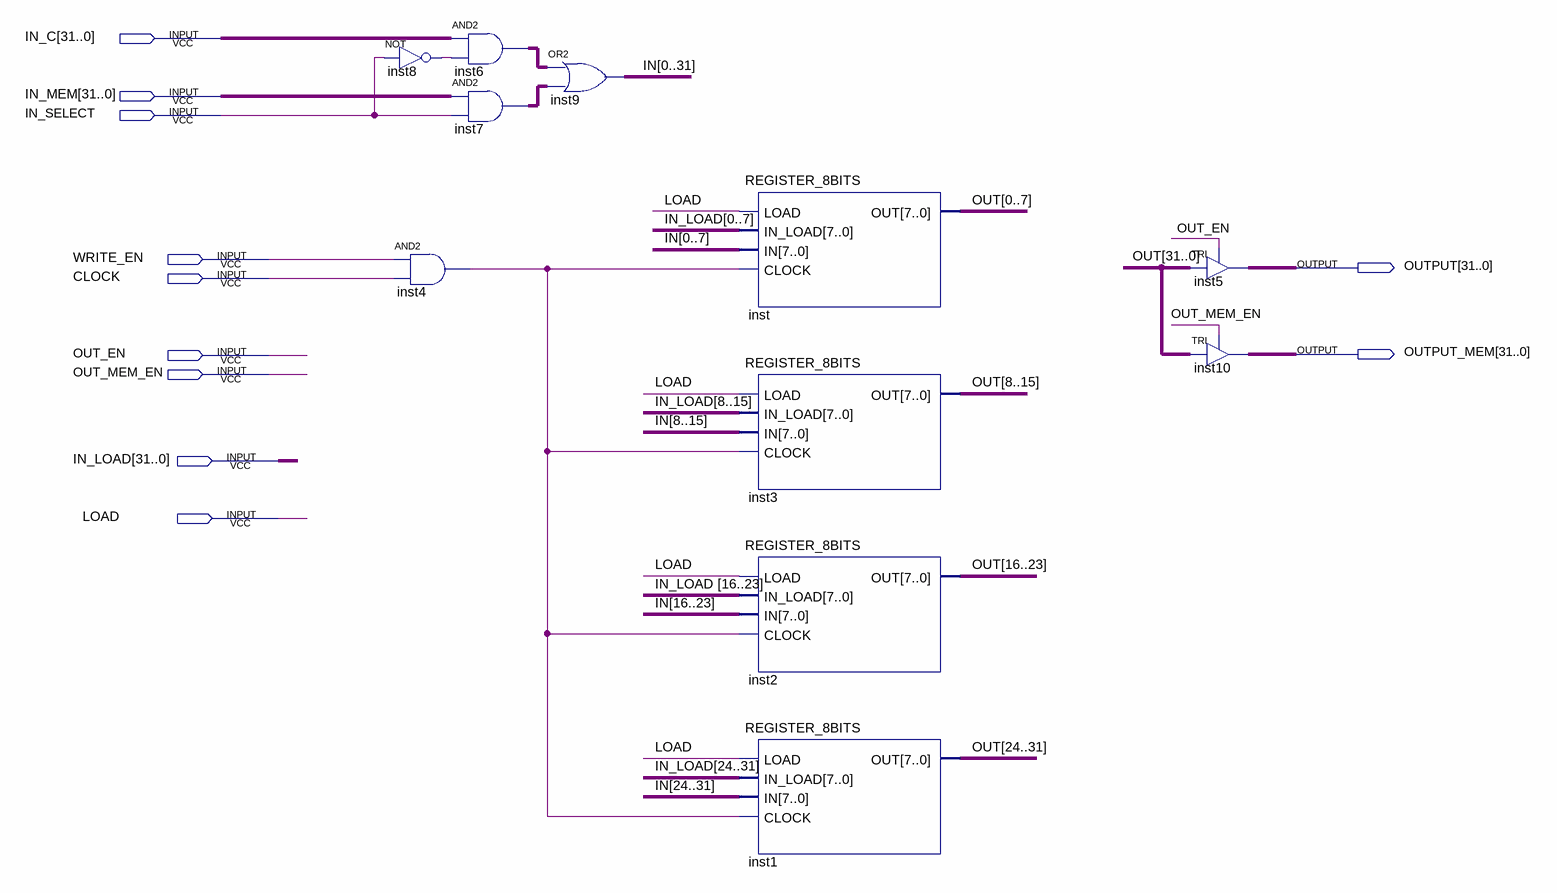
[diagram p0: schematic sheet]
// Quartus schematic REGISTER_32BITS.bdf as structural Verilog: 11 symbols, 11 pins
module REGISTER_32BITS (
  input  [31:0] IN_C,
  input  [31:0] IN_MEM,
  input  IN_SELECT,
  input  WRITE_EN,
  input  CLOCK,
  input  OUT_EN,
  input  OUT_MEM_EN,
  input  [31:0] IN_LOAD,
  input  LOAD,
  output [31:0] OUTPUT,
  output [31:0] OUTPUT_MEM
);

  wire inst4_out, inst8_out;
  wire [31:0] IN, inst6_out, inst7_out, OUT;

  assign inst6_out = IN_C & {32{inst8_out}};  // AND2 inst6, 32 bits wide
  not inst8 (inst8_out, IN_SELECT);
  assign inst7_out = IN_MEM & {32{IN_SELECT}};  // AND2 inst7, 32 bits wide
  and inst4 (inst4_out, WRITE_EN, CLOCK);
  assign {IN[0], IN[1], IN[2], IN[3], IN[4], IN[5], IN[6], IN[7], IN[8], IN[9], IN[10], IN[11], IN[12], IN[13], IN[14], IN[15], IN[16], IN[17], IN[18], IN[19], IN[20], IN[21], IN[22], IN[23], IN[24], IN[25], IN[26], IN[27], IN[28], IN[29], IN[30], IN[31]} = inst6_out | inst7_out;  // OR2 inst9, 32 bits wide
  REGISTER_8BITS inst (
    .LOAD(LOAD),
    .IN_LOAD({IN_LOAD[0], IN_LOAD[1], IN_LOAD[2], IN_LOAD[3], IN_LOAD[4], IN_LOAD[5], IN_LOAD[6], IN_LOAD[7]}),
    .IN({IN[0], IN[1], IN[2], IN[3], IN[4], IN[5], IN[6], IN[7]}), .CLOCK(inst4_out),
    .OUT({OUT[0], OUT[1], OUT[2], OUT[3], OUT[4], OUT[5], OUT[6], OUT[7]}));
  REGISTER_8BITS inst3 (
    .LOAD(LOAD),
    .IN_LOAD({IN_LOAD[8], IN_LOAD[9], IN_LOAD[10], IN_LOAD[11], IN_LOAD[12], IN_LOAD[13], IN_LOAD[14], IN_LOAD[15]}),
    .IN({IN[8], IN[9], IN[10], IN[11], IN[12], IN[13], IN[14], IN[15]}), .CLOCK(inst4_out),
    .OUT({OUT[8], OUT[9], OUT[10], OUT[11], OUT[12], OUT[13], OUT[14], OUT[15]}));
  REGISTER_8BITS inst2 (
    .LOAD(LOAD),
    .IN_LOAD({IN_LOAD[16], IN_LOAD[17], IN_LOAD[18], IN_LOAD[19], IN_LOAD[20], IN_LOAD[21], IN_LOAD[22], IN_LOAD[23]}),
    .IN({IN[16], IN[17], IN[18], IN[19], IN[20], IN[21], IN[22], IN[23]}), .CLOCK(inst4_out),
    .OUT({OUT[16], OUT[17], OUT[18], OUT[19], OUT[20], OUT[21], OUT[22], OUT[23]}));
  REGISTER_8BITS inst1 (
    .LOAD(LOAD),
    .IN_LOAD({IN_LOAD[24], IN_LOAD[25], IN_LOAD[26], IN_LOAD[27], IN_LOAD[28], IN_LOAD[29], IN_LOAD[30], IN_LOAD[31]}),
    .IN({IN[24], IN[25], IN[26], IN[27], IN[28], IN[29], IN[30], IN[31]}), .CLOCK(inst4_out),
    .OUT({OUT[24], OUT[25], OUT[26], OUT[27], OUT[28], OUT[29], OUT[30], OUT[31]}));
  TRI inst5[31:0] (.IN(OUT), .OE(OUT_EN), .OUT(OUTPUT));
  TRI inst10[31:0] (.IN(OUT), .OE(OUT_MEM_EN), .OUT(OUTPUT_MEM));
endmodule
